# Altium schematic sheet Distro_schematic.SchDoc
size A4
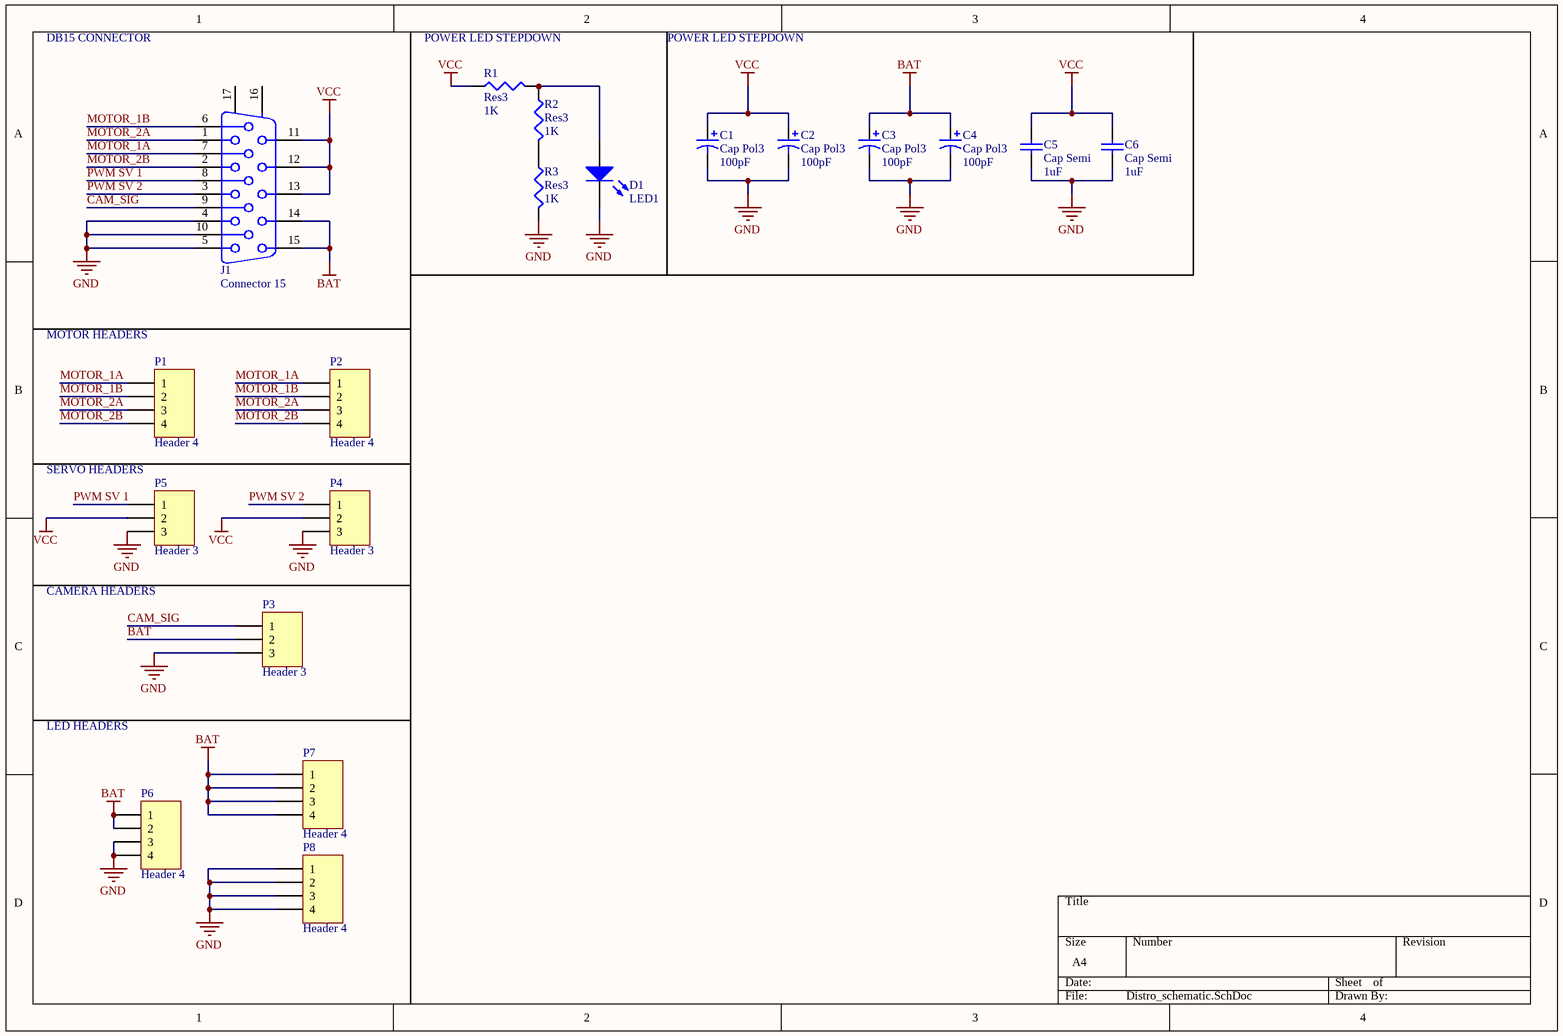
[diagram p0: Distro_schematic.SchDoc]

## Parts
C1  Cap Pol3  value 100pF  [C0805]
C2  Cap Pol3  value 100pF  [C0805]
C3  Cap Pol3  value 100pF  [C0805]
C4  Cap Pol3  value 100pF  [C0805]
C5  Cap Semi  value 1uF  [C1206]
C6  Cap Semi  value 1uF  [C1206]
D1  LED1  [L0603]
J1  Connector 15  [PCBComponent_1]
P1  Header 4  [HDR1X4]
P2  Header 4  [HDR1X4]
P3  Header 3  [HDR1X3]
P4  Header 3  [HDR1X3]
P5  Header 3  [HDR1X3]
P6  Header 4  [HDR1X4]
P7  Header 4  [HDR1X4]
P8  Header 4  [HDR1X4]
R1  Res3  value 1K  [J1-0603]
R2  Res3  value 1K  [J1-0603]
R3  Res3  value 1K  [J1-0603]

## Nets
BAT: C3.1 C4.1 J1.14 J1.15 P3.2 P6.1 P6.2 P7.1 P7.2 P7.3 P7.4
GND: C1.2 C2.2 C3.2 C4.2 C5.1 C6.1 D1.2(K) J1.4 J1.5 J1.10 P3.3 P4.3 P5.3 P6.3 P6.4 P8.1 P8.2 P8.3 P8.4 R3.2
VCC: C1.1 C2.1 C5.2 C6.2 J1.11 J1.12 J1.13 P4.2 P5.2 R1.1
CAM_SIG: J1.9 P3.1
MOTOR_1A: J1.7 P1.1 P2.1
MOTOR_1B: J1.6 P1.2 P2.2
MOTOR_2A: J1.1 P1.3 P2.3
MOTOR_2B: J1.2 P1.4 P2.4
PWM SV 1: J1.8 P5.1
PWM SV 2: J1.3 P4.1
NetD1_1: D1.1(A) R1.2 R2.1
NetR2_2: R2.2 R3.1

Not connected (* = marked no-connect by the designer): J1 16(MH1) 17(MH2)

## Notes on the sheet
- DB15 CONNECTOR
- POWER LED STEPDOWN
- (near P1) MOTOR HEADERS
- SERVO HEADERS
- CAMERA HEADERS
- LED HEADERS

## Library data of the parts
C1-C4 = Cap Pol3: Polarized Capacitor (Surface Mount); Published: 8-Jun-2000; LatestRevisionDate: 29-May-2009; LatestRevisionNote: IPC-7351 Footprint Added.; PackageReference: C0805; Publisher: Altium Limited; PackageDescription: Chip Capacitor
C5 C6 = Cap Semi: Capacitor (Semiconductor SIM Model); Published: 8-Jun-2000; LatestRevisionDate: 29-May-2009; LatestRevisionNote: IPC-7351 Footprint Added.; PackageReference: C1206; Publisher: Altium Limited; PackageDescription: Chip Capacitor
D1 = LED1: Typical RED GaAs LED; Published: 8-Jun-2000; LatestRevisionDate: 08-Jul-2005; LatestRevisionNote: Mech Layer 1 removed.; PackageReference: LED-1; Publisher: Altium Limited; PackageDescription: LED; 2 Leads
J1 = Connector 15: Receptacle Assembly, 15-Pin, Sim Line Connector; PackageDocument: B; Positions: 15; Gender: Receptacle Header; Published: 15-Jun-2001; LatestRevisionDate: 17-Jul-2002; LatestRevisionNote: Re-released for DXP Platform.; DatasheetDocument: 24-Nov-1999; PackageReference: 788574; Publisher: Altium Limited; Orientation: Right Angle
P1 P2 P6-P8 = Header 4: Header, 4-Pin; LatestRevisionDate: 17-Jul-2002; LatestRevisionNote: Re-released for DXP Platform.; Publisher: Altium Limited
P3-P5 = Header 3: Header, 3-Pin; LatestRevisionDate: 17-Jul-2002; LatestRevisionNote: Re-released for DXP Platform.; Publisher: Altium Limited
R1-R3 = Res3: Resistor; Published: 8-Jun-2000; LatestRevisionDate: 29-May-2009; LatestRevisionNote: IPC-7351 Footprint Added.; PackageReference: J1-0603; Publisher: Altium Limited; PackageDescription: Chip Resistor